# Altium schematic sheet 2-MCU部分.SchDoc
size A4; SheetNumber: 3; SheetTotal: 4
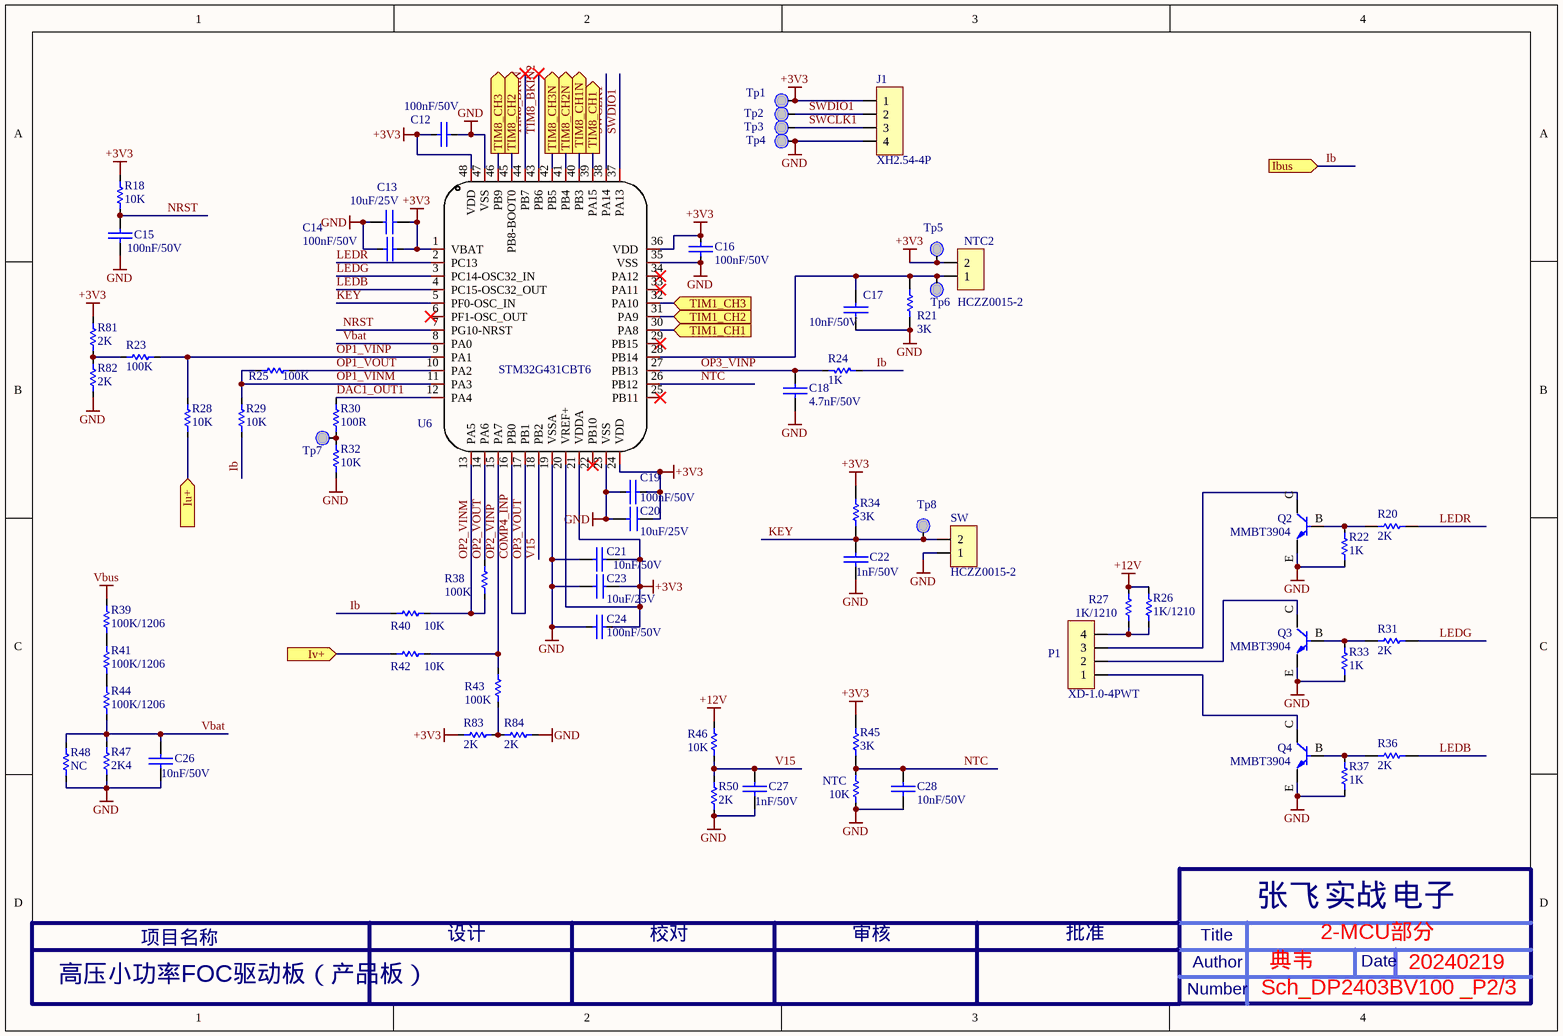
[diagram p0: 2-MCU部分.SchDoc]

## Parts
C12  100nF/50V  [C0603]
C13  10uF/25V  [C0805]
C14  100nF/50V  [C0603]
C15  100nF/50V  [C0603]
C16  100nF/50V  [C0603]
C17  10nF/50V  [C0603]
C18  4.7nF/50V  [C0603]
C19  100nF/50V  [C0603]
C20  10uF/25V  [C0805]
C21  10nF/50V  [C0603]
C22  1nF/50V  [C0603]
C23  10uF/25V  [C0805]
C24  100nF/50V  [C0603]
C26  10nF/50V  [C0603]
C27  1nF/50V  [C0603]
C28  10nF/50V  [C0603]
J1  XH2.54-4P  [SIP4]
NTC  10K  [R0603]
NTC2  HCZZ0015-2  [PIN-2-LS]
P1  XD-1.0-4PWT  [PIN-4-WS]
Q2  MMBT3904  [SOT-23-BCE]
Q3  MMBT3904  [SOT-23-BCE]
Q4  MMBT3904  [SOT-23-BCE]
R18  10K  [R0603]
R20  2K  [R0603]
R21  3K  [R0603]
R22  1K  [R0603]
R23  100K  [R0603]
R24  1K  [R0603]
R25  100K  [R0603]
R26  1K/1210  [R1210]
R27  1K/1210  [R1210]
R28  10K  [R0603]
R29  10K  [R0603]
R30  100R  [R0603]
R31  2K  [R0603]
R32  10K  [R0603]
R33  1K  [R0603]
R34  3K  [R0603]
R36  2K  [R0603]
R37  1K  [R0603]
R38  100K  [R0603]
R39  100K/1206  [R1206]
R40  10K  [R0603]
R41  100K/1206  [R1206]
R42  10K  [R0603]
R43  100K  [R0603]
R44  100K/1206  [R1206]
R45  3K  [R0603]
R46  10K  [R0603]
R47  2K4  [R0603]
R48  NC  [R0603]
R50  2K  [R0603]
R81  2K  [R0603]
R82  2K  [R0603]
R83  2K  [R0603]
R84  2K  [R0603]
SW  HCZZ0015-2  [PIN-2-LS]
Tp1  test point  [Test_Port]  (value not drawn)  (no BOM)
Tp2  test point  [Test_Port]  (value not drawn)  (no BOM)
Tp3  test point  [Test_Port]  (value not drawn)  (no BOM)
Tp4  test point  [Test_Port]  (value not drawn)  (no BOM)
Tp5  test point  [Test_Port]  (value not drawn)  (no BOM)
Tp6  test point  [Test_Port]  (value not drawn)  (no BOM)
Tp7  test point  [Test_Port]  (value not drawn)  (no BOM)
Tp8  test point  [Test_Port]  (value not drawn)  (no BOM)
U6  STM32G431CBT6  [LQFP-48]

## Ports
Ibus (in, see 0-模块总图[3B]), Iu+ (in, see 0-模块总图[3B]), Iv+ (in, see 0-模块总图[3B]), TIM1_CH1 (in, see 0-模块总图[2B]), TIM1_CH2 (in, see 0-模块总图[2B]), TIM1_CH3 (in, see 0-模块总图[2B]), TIM8_CH1 (out, see 0-模块总图[3B]), TIM8_CH1N (out, see 0-模块总图[3B]), TIM8_CH2 (out, see 0-模块总图[3B]), TIM8_CH2N (out, see 0-模块总图[3B]), TIM8_CH3 (out, see 0-模块总图[3B]), TIM8_CH3N (out, see 0-模块总图[3B])

## Nets
+3V3: C12.2 C13.2 C14.1 C16.2 C19.2 C20.1 C21.2 C23.1 C24.2 J1.1 NTC2.2 R18.1 R34.1 R45.1 R81.1 R83.1 Tp1.1(Test) Tp5.1(Test) U6.1(VBAT) U6.20(VREF+) U6.21(VDDA) U6.24(VDD) U6.36(VDD) U6.48(VDD)
+12V: R26.1 R27.1 R46.1
GND: C12.1 C13.1 C14.2 C15.2 C16.1 C17.1 C18.2 C19.1 C20.2 C21.1 C22.2 C23.2 C24.1 C26.2 C27.2 C28.1 J1.4 NTC.2 Q2.E Q3.E Q4.E R21.2 R22.2 R32.1 R33.2 R37.2 R47.1 R48.1 R50.1 R82.2 R84.2 SW.1 Tp4.1(Test) U6.19(VSSA) U6.23(VSS) U6.35(VSS) U6.47(VSS)
Vbus: R39.1
COMP4_INP: U6.16(PB0) U6.17(PB1)  [also labelled OP3_VOUT]
DAC1_OUT1: R30.1 U6.12(PA4)
Ib: R24.2 R29.1 R40.2 ; port Ibus
Iu+: R28.2 ; port Iu+
Iv+: R42.1 ; port Iv+
KEY: C22.1 R34.2 SW.2 Tp8.1(Test) U6.5(PF0-OSC_IN)
LEDB: R36.2 U6.4(PC15-OSC32_OUT)
LEDG: R31.2 U6.3(PC14-OSC32_IN)
LEDR: R20.2 U6.2(PC13)
NRST: C15.1 R18.2 U6.7(PG10-NRST)
NTC: C28.2 NTC.1 R45.2 U6.26(PB12)
OP1_VINM: R25.1 R29.2 U6.11(PA3)
OP1_VINP: R23.1 R28.1 U6.9(PA1)
OP1_VOUT: R25.2 U6.10(PA2)
OP2_VINM: R38.1 R40.1 U6.13(PA5)
OP2_VINP: R42.2 R43.1 U6.15(PA7)
OP2_VOUT: R38.2 U6.14(PA6)
OP3_VINP: C18.1 R24.1 U6.27(PB13)
SWCLK1: J1.3 Tp3.1(Test) U6.38(PA14)
SWDIO1: J1.2 Tp2.1(Test) U6.37(PA13)
TIM1_CH1: U6.30(PA8) ; port TIM1_CH1
TIM1_CH2: U6.31(PA9) ; port TIM1_CH2
TIM1_CH3: U6.32(PA10) ; port TIM1_CH3
TIM8_BKIN: U6.44(PB7)
TIM8_BKIN2: U6.43(PB6)
TIM8_CH1: U6.39(PA15) ; port TIM8_CH1
TIM8_CH1N: U6.40(PB3) ; port TIM8_CH1N
TIM8_CH2: U6.45(PB8-BOOT0) ; port TIM8_CH2
TIM8_CH2N: U6.41(PB4) ; port TIM8_CH2N
TIM8_CH3: U6.46(PB9) ; port TIM8_CH3
TIM8_CH3N: U6.42(PB5) ; port TIM8_CH3N
V15: C27.1 R46.2 R50.2 U6.18(PB2)
Vbat: C26.1 R44.2 R47.2 R48.2 U6.8(PA0)
NetC17_2: C17.2 NTC2.1 R21.1 Tp6.1(Test) U6.28(PB14)
NetP1_1: P1.1 Q4.C
NetP1_2: P1.2 Q3.C
NetP1_3: P1.3 Q2.C
NetP1_4: P1.4 R26.2 R27.2
NetQ2_B: Q2.B R20.1 R22.1
NetQ3_B: Q3.B R31.1 R33.1
NetQ4_B: Q4.B R36.1 R37.1
NetR23_2: R23.2 R81.2 R82.1
NetR30_2: R30.2 R32.2 Tp7.1(Test)
NetR39_2: R39.2 R41.1
NetR41_2: R41.2 R44.1
NetR43_2: R43.2 R83.2 R84.1

Not connected (* = marked no-connect by the designer): U6 6(PF1-OSC_OUT)* 22(PB10)* 25(PB11)* 29(PB15)* 33(PA11)* 34(PA12)*

## Notes on the sheet
- 高压小功率FOC驱动板（产品板）
- 典韦
- 2-MCU部分
- 20240219
- Sch_DP2403BV100 _P2/3
- 张飞
- 实战
- 电子
- 项目名称
- 设计
- 校对
- 审核
- 批准
- Author
- Title
- Date
- Number

## Library data of the parts
C12 C14 C16 C19 C24 = CAP NP: 贴片电容
C13 C20 C23 = CAP NP_0: 贴片电容; Manufacturer: TDK; Dielectric: <Dielectric>; Voltage: <Voltage>; RK PN: C1005X5R0J104K050BA; Priority: A; parameter: <parameter>; Manufacturer PN: C1005X5R0J104K050BA; Created by: JJJ
C15 C17 C18 C21 C22 C26-C28 = CAP: 贴片电容
J1 = 4PIN: 接插件
NTC = Res: NTC=10K; Manufacturer: Generic Components; Class: Passive; SubClass: Resistor; Value: 0.125W; Published: 08/06/2000; Publisher: Altium Hobart Technology Centre; Package: 0805
NTC2 SW = 2PIN: HCZZ0015-2,2P,1.25mm
P1 = 4PIN: XD-1.0-4PWT,1*4P
Q2-Q4 = BJT-NPN: 三极管; Part Number: *; Brand: *
R18 R20-R34 R36-R48 R50 R81-R84 = Res: 电阻; Manufacturer: Generic Components; Class: Passive; SubClass: Resistor; Value: 0.125W; Published: 08/06/2000; Publisher: Altium Hobart Technology Centre; Package: 0805
U6 = STM32G431CBT6: Manufacturer: ST(意法半导体); Add into BOM: yes; CPU Core: ARM-M系列; CPU Maximum Speed: 170MHz; Operating Voltage Range: 1.71V~3.6V; Program Storage Size: 128KB; Program Memory Type: FLASH; RAM Size: 32KB; GPIO Ports Number: 38; ADC (Bit): 12bit; Peripheral/Function: DMA；PWM; Watchdog: 有; Name: STM32G431CBT6; Symbol: STM32G431CBT6; Device: STM32G431CBT6; LCSC Part Name: ARM-M系列 170MHz; Supplier Part: C529355; Manufacturer Part: STM32G431CBT6; Supplier Footprint: LQFP-48(7x7); JLCPCB Part Class: Extended Part; Datasheet: https://atta.szlcsc.com/upload/public/pdf/source/20200511/C529354_7C66CF00837B904D0C15DCE45B69418C.pdf; Supplier: LCSC; Convert to PCB: yes; EEPROM: -; DAC (Bit): 12bit; PWM (Bit): -; Universal Serial Bus: -; Internal Comparator: -; communication protocol: -; Real-Time Clock: -; Infrared Data Association: 有; Low-Voltage Detect: 有; CCP Capture/Compare: -; Secure Digital Input and Output: -; Direct Memory Access: 有; Internal Oscillator: 有; Operating Temperature Range: -40℃~+85℃
Tp1-Tp8 = test point: 编号: *; 规格: *